# Altium project PS_DC-DC_15V_24V.PrjPcb
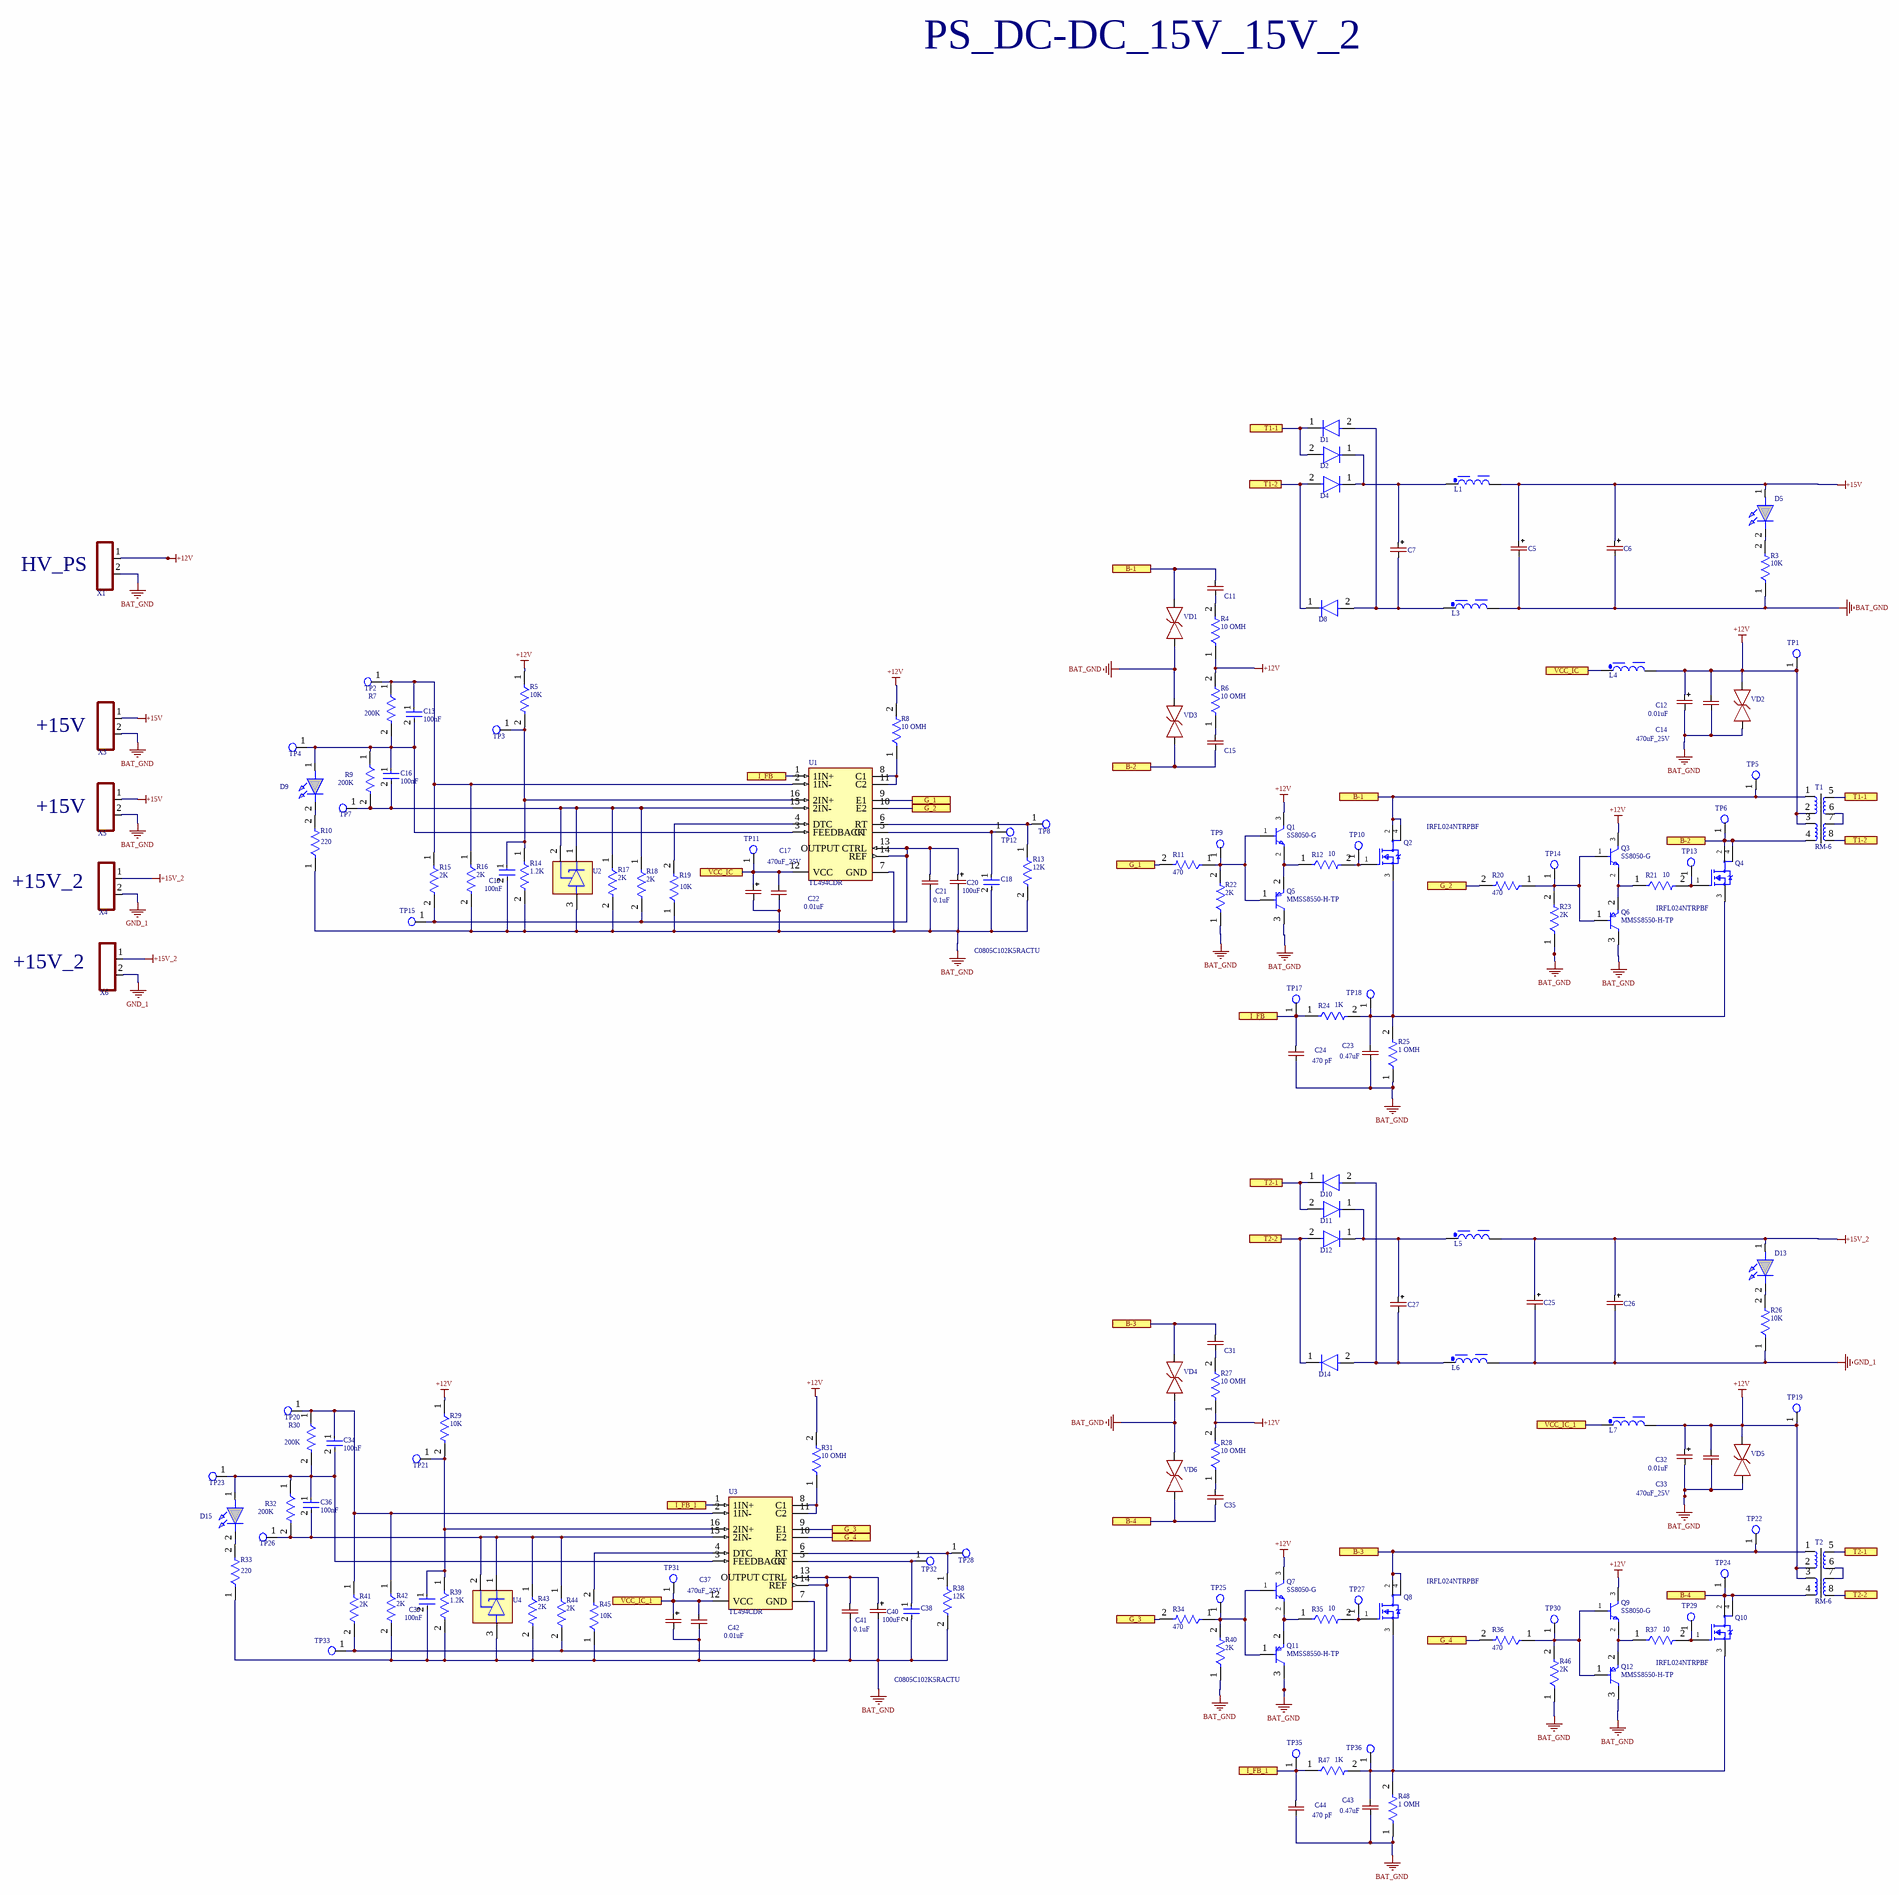
[diagram p0: PS_DC-DC_15V_24V.SchDoc]
1 sheet, 161 parts. Net scope: flat (ports and power ports of the same name join across sheets).
Board file: PS_DC-DC_15V_24V.PcbDoc

## Sheet PS_DC-DC_15V_24V.SchDoc
size A0; SheetNumber: 1; SheetTotal: 1; SPICEModelCacheYQEDCYZF: <root> / <DocumentId>YQEDCYZF</DocumentId> / <CacheFrame Number="0"> / <Model Name="7850_744775239_390u" Kind="CKT"> / <Text>******* / .subckt 7850_744775239_390u 1 2 / Rp 1 2 180000 / Cp 1 2 5p / Rs 1 N3 1.151 / L1 N3 2 390u / .ends 7850_744775239_390u</Text> / </Model> / </CacheFrame> / </root>

### Parts
C5  CAP-POLAR  [CAP_SMD_Size_G]  (value not drawn)
C6  CAP-POLAR  [CAP_SMD_Size_G]  (value not drawn)
C7  CAP-POLAR  [CAP_SMD_Size_G]  (value not drawn)
C11  CAP-V  [CAP-V]  (value not drawn)
C12  0.01uF  [CAP-0805]
C13  100nF  [FP-C0805C-DN-MFG]
C14  470uF_25V  [CAP_SMD_Size_G]
C15  CAP-V  [CAP-V]  (value not drawn)
C16  100nF  [FP-C0805C-DN-MFG]
C17  470uF_25V  [CAP_SMD_Size_G]
C18  C0805C102K5RACTU  [FP-C0805C-DN-MFG]
C19  100nF  [FP-C0805C-DN-MFG]
C20  100uF  [CAP-TAN-D]
C21  0.1uF  [CAP-0805]
C22  0.01uF  [CAP-0805]
C23  0.47uF  [CAP-0805]
C24  470 pF  [CAP-0805]
C25  CAP-POLAR  [CAP_SMD_Size_G]  (value not drawn)
C26  CAP-POLAR  [CAP_SMD_Size_G]  (value not drawn)
C27  CAP-POLAR  [CAP_SMD_Size_G]  (value not drawn)
C31  CAP-V  [CAP-V]  (value not drawn)
C32  0.01uF  [CAP-0805]
C33  470uF_25V  [CAP_SMD_Size_G]
C34  100nF  [FP-C0805C-DN-MFG]
C35  CAP-V  [CAP-V]  (value not drawn)
C36  100nF  [FP-C0805C-DN-MFG]
C37  470uF_25V  [CAP_SMD_Size_G]
C38  C0805C102K5RACTU  [FP-C0805C-DN-MFG]
C39  100nF  [FP-C0805C-DN-MFG]
C40  100uF  [CAP-TAN-D]
C41  0.1uF  [CAP-0805]
C42  0.01uF  [CAP-0805]
C43  0.47uF  [CAP-0805]
C44  470 pF  [CAP-0805]
D1  US1G  [DO-214AA]  (value not drawn)
D2  US1G  [DO-214AA]  (value not drawn)
D4  US1G  [DO-214AA]  (value not drawn)
D5  151031YS06000  [LED_RED]  (value not drawn)
D8  US1G  [DO-214AA]  (value not drawn)
D9  151031YS06000  [LED_RED]  (value not drawn)
D10  US1G  [DO-214AA]  (value not drawn)
D11  US1G  [DO-214AA]  (value not drawn)
D12  US1G  [DO-214AA]  (value not drawn)
D13  151031YS06000  [LED_RED]  (value not drawn)
D14  US1G  [DO-214AA]  (value not drawn)
D15  151031YS06000  [LED_RED]  (value not drawn)
L1  390µH, 0.38A  [WE-PD2_7850]  (value not drawn)
L3  390µH, 0.38A  [WE-PD2_7850]  (value not drawn)
L4  390µH, 0.38A  [WE-PD2_7850]  (value not drawn)
L5  390µH, 0.38A  [WE-PD2_7850]  (value not drawn)
L6  390µH, 0.38A  [WE-PD2_7850]  (value not drawn)
L7  390µH, 0.38A  [WE-PD2_7850]  (value not drawn)
Q1  SS8050-G  [FP-SS8050-G-MFG]
Q2  IRFL024NTRPBF  [FP-PG-SOT223-3-IPC_B]
Q3  SS8050-G  [FP-SS8050-G-MFG]
Q4  IRFL024NTRPBF  [FP-PG-SOT223-3-IPC_B]
Q5  MMSS8550-H-TP  [FP-SOT-23-IPC_B]
Q6  MMSS8550-H-TP  [FP-SOT-23-IPC_B]
Q7  SS8050-G  [FP-SS8050-G-MFG]
Q8  IRFL024NTRPBF  [FP-PG-SOT223-3-IPC_B]
Q9  SS8050-G  [FP-SS8050-G-MFG]
Q10  IRFL024NTRPBF  [FP-PG-SOT223-3-IPC_B]
Q11  MMSS8550-H-TP  [FP-SOT-23-IPC_B]
Q12  MMSS8550-H-TP  [FP-SOT-23-IPC_B]
R3  10K  [RES-0805]
R4  10 OMH  [RES-1206]
R5  10K  [FP-CRCW0805-e3-MFG]
R6  10 OMH  [RES-1206]
R7  200K  [FP-CRCW0805-e3-MFG]
R8  10 OMH  [RES-1206]
R9  200K  [FP-CRCW0805-e3-MFG]
R10  220  [RES-0805]
R11  470  [RES-0805]
R12  10  [RES-0805]
R13  12K  [FP-CRCW0805-e3-MFG]
R14  1.2K  [FP-CRCW0805-e3-MFG]
R15  2K  [FP-CRCW0805-e3-MFG]
R16  2K  [FP-CRCW0805-e3-MFG]
R17  2K  [FP-CRCW0805-e3-MFG]
R18  2K  [FP-CRCW0805-e3-MFG]
R19  10K  [RES-0805]
R20  470  [RES-0805]
R21  10  [RES-0805]
R22  2K  [RES-0805]
R23  2K  [RES-0805]
R24  1K  [RES-0805]
R25  1 OMH  [RES-2512]
R26  10K  [RES-0805]
R27  10 OMH  [RES-1206]
R28  10 OMH  [RES-1206]
R29  10K  [FP-CRCW0805-e3-MFG]
R30  200K  [FP-CRCW0805-e3-MFG]
R31  10 OMH  [RES-1206]
R32  200K  [FP-CRCW0805-e3-MFG]
R33  220  [RES-0805]
R34  470  [RES-0805]
R35  10  [RES-0805]
R36  470  [RES-0805]
R37  10  [RES-0805]
R38  12K  [FP-CRCW0805-e3-MFG]
R39  1.2K  [FP-CRCW0805-e3-MFG]
R40  2K  [RES-0805]
R41  2K  [FP-CRCW0805-e3-MFG]
R42  2K  [FP-CRCW0805-e3-MFG]
R43  2K  [FP-CRCW0805-e3-MFG]
R44  2K  [FP-CRCW0805-e3-MFG]
R45  10K  [RES-0805]
R46  2K  [RES-0805]
R47  1K  [RES-0805]
R48  1 OMH  [RES-2512]
T1  RM-6  [TRANS_RM6]
T2  RM-6  [TRANS_RM6]
TP1  (no value)  [Test_Point]
TP2  Test_Point_PCB  [Test_Point]  (value not drawn)
TP3  Test_Point_PCB  [Test_Point]  (value not drawn)
TP4  Test_Point_PCB  [Test_Point]  (value not drawn)
TP5  (no value)  [Test_Point]
TP6  (no value)  [Test_Point]
TP7  (no value)  [Test_Point]
TP8  (no value)  [Test_Point]
TP9  (no value)  [Test_Point]
TP10  (no value)  [Test_Point]
TP11  (no value)  [Test_Point]
TP12  Test_Point_PCB  [Test_Point]  (value not drawn)
TP13  (no value)  [Test_Point]
TP14  (no value)  [Test_Point]
TP15  Test_Point_PCB  [Test_Point]  (value not drawn)
TP17  (no value)  [Test_Point]
TP18  (no value)  [Test_Point]
TP19  (no value)  [Test_Point]
TP20  Test_Point_PCB  [Test_Point]  (value not drawn)
TP21  Test_Point_PCB  [Test_Point]  (value not drawn)
TP22  (no value)  [Test_Point]
TP23  Test_Point_PCB  [Test_Point]  (value not drawn)
TP24  (no value)  [Test_Point]
TP25  (no value)  [Test_Point]
TP26  (no value)  [Test_Point]
TP27  (no value)  [Test_Point]
TP28  (no value)  [Test_Point]
TP29  (no value)  [Test_Point]
TP30  (no value)  [Test_Point]
TP31  (no value)  [Test_Point]
TP32  Test_Point_PCB  [Test_Point]  (value not drawn)
TP33  Test_Point_PCB  [Test_Point]  (value not drawn)
TP35  (no value)  [Test_Point]
TP36  (no value)  [Test_Point]
U1  TL494CDR  [D0016A_N]
U2  TL431  [TL431_SOT-23-3(A)]  (value not drawn)
U3  TL494CDR  [D0016A_N]
U4  TL431  [TL431_SOT-23-3(A)]  (value not drawn)
VD1  Suppressor  [P6KE350CA]  (value not drawn)
VD2  Suppressor  [DO-214AA]  (value not drawn)
VD3  Suppressor  [P6KE350CA]  (value not drawn)
VD4  Suppressor  [P6KE350CA]  (value not drawn)
VD5  Suppressor  [DO-214AA]  (value not drawn)
VD6  Suppressor  [P6KE350CA]  (value not drawn)
X1  CONN-2-PIN  [XH2-]  (value not drawn)
X3  CONN-2-PIN  [XH2-]  (value not drawn)
X4  CONN-2-PIN  [XH2-]  (value not drawn)
X5  CONN-2-PIN  [XH2-]  (value not drawn)
X6  CONN-2-PIN  [XH2-]  (value not drawn)

### Ports
B-1, B-2, B-3, B-4, G_1, G_2, G_3, G_4, I_FB, I_FB_1, T1-1, T1-2, T2-1, T2-2, VCC_IC, VCC_IC_1

### Nets
+12V: C12.2 C14.1(+) C32.2 C33.1(+) L4.2 L7.2 Q1.3(C) Q3.3(C) Q7.3(C) Q9.3(C) R4.1 R5.1 R6.2 R8.2 R27.1 R28.2 R29.1 R31.2 T1.2 T1.3 T2.2 T2.3 TP1.1(G9) TP19.1(G9) VD2.2(A) VD5.2(A) X1.1
+15V: C5.1(+) C6.1(+) D5.1(A) L1.2 X3.1 X5.1
+15V_2: C25.1(+) C26.1(+) D13.1(A) L5.2 X4.1 X6.1
BAT_GND: C5.2(-) C6.2(-) C12.1 C14.2(-) C17.2(-) C18.2 C19.2 C20.2(-) C21.1 C22.1 C23.1 C24.1 C32.1 C33.2(-) C37.2(-) C38.2 C39.2 C40.2(-) C41.1 C42.1 C43.1 C44.1 L3.2 Q5.3(C) Q6.3(C) Q11.3(C) Q12.3(C) R3.1 R10.1 R13.2 R14.2 R16.2 R17.2 R19.1 R22.1 R23.1 R25.1 R33.1 R38.2 R39.2 R40.1 R42.2 R43.2 R45.1 R46.1 R48.1 U1.7(GND) U2.3(A) U3.7(GND) U4.3(A) VD1.1(C) VD2.1(C) VD3.2(A) VD4.1(C) VD5.1(C) VD6.2(A) X1.2 X3.2 X5.2
GND_1: C25.2(-) C26.2(-) L6.2 R26.1 X4.2 X6.2
NetC7_1: C7.1(+) D2.1(C) D4.1(C) L1.1
NetC7_2: C7.2(-) D1.2(A) D8.2(A) L3.1
NetC11_1: C11.1 R4.2
NetC11_2: C11.2 Q2.2(D) Q2.4(D) T1.1 TP5.1(G9) VD1.2(A) ; port B-1
NetC13_1: C13.1 R7.1 R15.1 R16.1 TP2.1(G9) U1.2(1IN-)
NetC13_2: C13.2 C16.1 D9.1(A) R7.2 R9.1 TP4.1(G9) U1.3(FEEDBACK)
NetC15_1: C15.1 Q4.2(D) Q4.4(D) T1.4 TP6.1(G9) VD3.1(C) ; port B-2
NetC15_2: C15.2 R6.1
NetC16_2: C16.2 R9.2 R17.1 R18.1 TP7.1(G9) U1.15(2IN-) U2.1(C) U2.2(REF)
NetC17_1: C17.1(+) C22.2 L4.1 TP11.1(G9) U1.12(VCC) ; port VCC_IC
NetC18_1: C18.1 TP12.1(G9) U1.5(CT)
NetC19_1: C19.1 R5.2 R14.1 TP3.1(G9) U1.16(2IN+)
NetC20_1: C20.1(+) C21.2 R15.2 R18.2 TP15.1(G9) U1.13(OUTPUT_CTRL) U1.14(REF)
NetC23_2: C23.2 Q2.3(S) Q4.3(S) R24.2 R25.2 TP18.1(G9)
NetC24_2: C24.2 R24.1 TP17.1(G9) U1.1(1IN+) ; port I_FB
NetC27_1: C27.1(+) D11.1(C) D12.1(C) L5.1
NetC27_2: C27.2(-) D10.2(A) D14.2(A) L6.1
NetC31_1: C31.1 R27.2
NetC31_2: C31.2 Q8.2(D) Q8.4(D) T2.1 TP22.1(G9) VD4.2(A) ; port B-3
NetC34_1: C34.1 R30.1 R41.1 R42.1 TP20.1(G9) U3.2(1IN-)
NetC34_2: C34.2 C36.1 D15.1(A) R30.2 R32.1 TP23.1(G9) U3.3(FEEDBACK)
NetC35_1: C35.1 Q10.2(D) Q10.4(D) T2.4 TP24.1(G9) VD6.1(C) ; port B-4
NetC35_2: C35.2 R28.1
NetC36_2: C36.2 R32.2 R43.1 R44.1 TP26.1(G9) U3.15(2IN-) U4.1(C) U4.2(REF)
NetC37_1: C37.1(+) C42.2 L7.1 TP31.1(G9) U3.12(VCC) ; port VCC_IC_1
NetC38_1: C38.1 TP32.1(G9) U3.5(CT)
NetC39_1: C39.1 R29.2 R39.1 TP21.1(G9) U3.16(2IN+)
NetC40_1: C40.1(+) C41.2 R41.2 R44.2 TP33.1(G9) U3.13(OUTPUT_CTRL) U3.14(REF)
NetC43_2: C43.2 Q8.3(S) Q10.3(S) R47.2 R48.2 TP36.1(G9)
NetC44_2: C44.2 R47.1 TP35.1(G9) U3.1(1IN+) ; port I_FB_1
NetD1_1: D1.1(C) D2.2(A) T1.5 ; port T1-1
NetD4_2: D4.2(A) D8.1(C) T1.8 ; port T1-2
NetD5_2: D5.2(K) R3.2
NetD9_2: D9.2(K) R10.2
NetD10_1: D10.1(C) D11.2(A) T2.5 ; port T2-1
NetD12_2: D12.2(A) D14.1(C) T2.8 ; port T2-2
NetD13_2: D13.2(K) R26.2
NetD15_2: D15.2(K) R33.2
NetQ1_1: Q1.1(B) Q5.1(B) R11.1 R22.2 TP9.1(G9)
NetQ1_2: Q1.2(E) Q5.2(E) R12.1
NetQ2_1: Q2.1(G) R12.2 TP10.1(G9)
NetQ3_1: Q3.1(B) Q6.1(B) R20.1 R23.2 TP14.1(G9)
NetQ3_2: Q3.2(E) Q6.2(E) R21.1
NetQ4_1: Q4.1(G) R21.2 TP13.1(G9)
NetQ7_1: Q7.1(B) Q11.1(B) R34.1 R40.2 TP25.1(G9)
NetQ7_2: Q7.2(E) Q11.2(E) R35.1
NetQ8_1: Q8.1(G) R35.2 TP27.1(G9)
NetQ9_1: Q9.1(B) Q12.1(B) R36.1 R46.2 TP30.1(G9)
NetQ9_2: Q9.2(E) Q12.2(E) R37.1
NetQ10_1: Q10.1(G) R37.2 TP29.1(G9)
NetR8_1: R8.1 U1.8(C1) U1.11(C2)
NetR11_2: R11.2 U1.9(E1) ; port G_1
NetR13_1: R13.1 TP8.1(G9) U1.6(RT)
NetR19_2: R19.2 U1.4(DTC)
NetR20_2: R20.2 U1.10(E2) ; port G_2
NetR31_1: R31.1 U3.8(C1) U3.11(C2)
NetR34_2: R34.2 U3.9(E1) ; port G_3
NetR36_2: R36.2 U3.10(E2) ; port G_4
NetR38_1: R38.1 TP28.1(G9) U3.6(RT)
NetR45_2: R45.2 U3.4(DTC)
NetT1_6: T1.6 T1.7
NetT2_6: T2.6 T2.7

### Notes on the sheet
- PS_DC-DC_15V_15V_2
- HV_PS
- +15V
- +15V_2

### Library data of the parts
C12 C21-C24 C32 C41-C44 = CAP-NON-POLAR
C13 C16 C19 C34 C36 C39 = CMP-2007-00254-2: CAP CER 10000PF 50V X7R 0805; Manufacturer Part Number: C0805C103J5RACTU; Manufacturer: KEMET; Value: 10,000 pF; Material: Ceramic; Temperature Coefficient: 30ppm/°C; Tolerance: 0.05; Device Class L1: Passive Components; Temperature: -55°C to +125°C; Lead Free: Yes; ComponentLink2URL: https://content.kemet.com/datasheets/KEM_C1003_C0G_SMD.pdf; Device Class L3: Ceramic Capacitors; Temperature Characteristic: X7R; Temperature Range High: +125°C; Mouser Description: Capacitor; Ceramic; Cap 0.01uF; Tol 5%; Vol-Rtg 50 V; SMT; Case 0805; X7R; TR; ComponentLink2Description: Datasheet; Height: 0.88mm; Digikey Description: CAP CER 10000PF 50V X7R 0805; Capacitance: 10,000 pF; Temperature Range Low: -55°C; Device Class L2: Capacitors; Octopart: https://octopart.com/c0805c103j5ractu-kemet-133473; Voltage Rating: 50 V; Category: Cap; RoHS: TRUE; Automotive: No; Package: C0805C-DN; Ipc Land Pattern Name: CAPC200125X78
C14 C17 C20 C33 C37 C40 = CAP-POLAR
C18 C38 = CMP-2007-01097-2: CAP CER 1000PF 50V X7R 0805; Manufacturer: KEMET; Capacitance: 1,000 pF; Value: 1,000 pF; Tolerance: 0.1; Temperature Coefficient: 30ppm/°C; Material: Ceramic; Temperature Range High: +125°C; Automotive: No; Device Class L3: Ceramic Capacitors; Category: Cap; Height: 0.88mm; Ipc Land Pattern Name: CAPC200125X78; Mouser Description: Cap Ceramic 0.001uF 50V X7R 10% SMD 0805 125C Plastic T/R; Device Class L1: Passive Components; Lead Free: Yes; Temperature Range Low: -55°C; ComponentLink2URL: https://content.kemet.com/datasheets/KEM_C1003_C0G_SMD.pdf; Octopart: https://octopart.com/c0805c102k5ractu-kemet-93010; Temperature: -55°C to +125°C; Package: C0805C-DN; RoHS: TRUE; Voltage Rating: 50 V; ComponentLink2Description: Datasheet; Digikey Description: CAP CER 1000PF 50V X7R 0805; Device Class L2: Capacitors; Manufacturer Part Number: C0805C102K5RACTU; Temperature Characteristic: X7R
D5 D9 D13 D15 = LED: WURTH ELEKTRONIK - 151031YS06000 - LED, Yellow, Through Hole, T-1 (3mm), 30 mA, 2 V, 590 nm; Geometry.Height: 5.5mm; Manufacturer_Name: Wurth Elektronik; Manufacturer_Part_Number: 151031YS06000; Mouser Part Number: 710-151031YS06000; Mouser Price/Stock: https://www.mouser.co.uk/ProductDetail/Wurth-Elektronik/151031YS06000?qs=LlUlMxKIyB3xSYYW%252BcuBiQ%3D%3D; Arrow Part Number: *; Arrow Price/Stock: *; Mouser Testing Part Number: *; Mouser Testing Price/Stock: *; Datasheet Link: https://katalog.we-online.de/led/datasheet/151031YS06000.pdf
L1 L3-L7 = 744775239: WE-PD2 SMT Power Inductor, size 7850, 390µH, 0.38A, 1.77Ω; Manufacturer: Wurth Elektronik; Case/Size Code: 7850; DC Resistance: 1.151Ω; Saturation Current: 0.43A; Self Resonant Frequency: 3.9MHz; Manufacturer Part Number: 744775239; Category: Unshielded Power Inductors; Match Code: WE-PD2; ComponentLink1Description: Website Link; ComponentLink1URL: https://www.we-online.com/redexpert/article/744775239?ad; ComponentLink2Description: Datasheet Link; ComponentLink2URL: https://www.we-online.com/redexpert/spec/744775239?ad; Mount: Surface Mount; Operating Temperature Max: 125°C; Operating Temperature Min: -40°C; Packaging: Tape and Reel; Length: 7.8mm; Width: 7mm; Height: 4.95mm; DC Resistance Max: 1.77Ω; Inductance: 390µH; Rated Current: 0.38A
Q1 Q3 Q7 Q9 = CMP-20235-000001-1: NPN TRANSISTOR 1.5A 40V SOT-23 R; Transition Frequency: 100MHz; Max Breakdown Voltage: 25V; Collector Emitter Voltage (VCEO): 400mV; Max Power Dissipation: 300mW; Max Collector Current: 1.5A; Case/Package: TO-236-3; Packaging: Tape and Reel; RoHS Compliant: Yes; Mount: Surface Mount; Collector Emitter Breakdown Voltage: 25V
Q2 Q4 Q8 Q10 = CMP-32901-001217-1: MOSFET N-CH 55V 2.8A SOT223; Max Power Dissipation: 1W; Turn-On Delay Time: 8.1ns; Drain to Source Resistance: 75mR; Gate to Source Voltage (Vgs): 20V; Polarization: N; Turn-Off Delay Time: 22.2ns; Threshold Voltage: 4V; Power Dissipation: 2.1W; Input Capacitance: 400pF; Number of Pins: 3; Max Operating Temperature: 150°C; Drain to Source Voltage (Vdss): 55V; RoHS Compliant: Yes; Case/Package: SOT-223; Series: HEXFET®; Lead Free: Contains Lead; Max Dual Supply Voltage: 55V; Packaging: Cut Tape; Drain to Source Breakdown Voltage: 55V; Reach SVHC Compliant: Yes; Mount: Surface Mount; Height: 0.057inch; Width: 0.146inch; Min Operating Temperature: -55°C; Rds On Max: 75mR; Halogen Free: Halogen Free; Continuous Drain Current (ID): 2.8A; Length: 0.263inch
Q5 Q6 Q11 Q12 = CMP-56214-000002-1: TRANS PNP 25V 1.5A SOT23; Emitter Base Voltage (VEBO): 1.6V; Collector Base Voltage (VCBO): 40V; Collector Emitter Saturation Voltage: 500mV; Max Power Dissipation: 625mW; Transition Frequency: 100MHz; Element Configuration: Single; hFE Min: 40; Polarity: PNP; Lead Free: Lead Free; Max Breakdown Voltage: 25V; Package Quantity: 1; Min Operating Temperature: -55°C; Case/Package: SOT-23; Max Collector Current: 1.5A; Mount: Surface Mount; Packaging: Tape and Reel; Collector Emitter Voltage (VCEO): 500mV; Max Operating Temperature: 150°C; Gain Bandwidth Product: 100MHz; Collector Emitter Breakdown Voltage: 25V
R3 R4 R6 R8 R10-R12 R19-R28 R31 R33-R37 R40 R45-R48 = RES-CONST
R5 R7 R9 R14 R15 R17 R18 R29 R30 R32 R39 R41 R43 R44 = CMP-2001-04908-2: RES Thick Film, 2kΩ, 1%, 0.125W, 100ppm/°C, 0805; Resistance: 10kR; Voltage Rating (DC): 150V; Power Rating: 125mW; Weight: 0.000194oz; Package Quantity: 5000; Military Standard: Not; Max Operating Temperature: 155°C; Temperature Coefficient: 100ppm/°C; Contact Plating: Tin; Width: 1.25mm; Height: 0.45mm; Radiation Hardening: No; Tolerance: 1%; Min Operating Temperature: -55°C; Voltage Rating: 150V; Length: 2mm; Depth: 1.25mm; Termination: SMD/SMT; Packaging: Tape and Reel; Case/Package: 0805; Case Code (Metric): 2012; Lead Free: Lead Free; Case Code (Imperial): 0805; Composition: Thick Film
R13 R38 = CMP-2001-04908-2: RES Thick Film, 12kΩ, 1%, 0.125W, 100ppm/°C, 0805; Resistance: 10kR; Voltage Rating (DC): 150V; Power Rating: 125mW; Weight: 0.000194oz; Package Quantity: 5000; Military Standard: Not; Max Operating Temperature: 155°C; Temperature Coefficient: 100ppm/°C; Contact Plating: Tin; Width: 1.25mm; Height: 0.45mm; Radiation Hardening: No; Tolerance: 1%; Min Operating Temperature: -55°C; Voltage Rating: 150V; Length: 2mm; Depth: 1.25mm; Termination: SMD/SMT; Packaging: Tape and Reel; Case/Package: 0805; Case Code (Metric): 2012; Lead Free: Lead Free; Case Code (Imperial): 0805; Composition: Thick Film
R16 R42 = CMP-2001-04908-2: RES Thick Film, 82kΩ, 1%, 0.125W, 100ppm/°C, 0805; Resistance: 10kR; Voltage Rating (DC): 150V; Power Rating: 125mW; Weight: 0.000194oz; Package Quantity: 5000; Military Standard: Not; Max Operating Temperature: 155°C; Temperature Coefficient: 100ppm/°C; Contact Plating: Tin; Width: 1.25mm; Height: 0.45mm; Radiation Hardening: No; Tolerance: 1%; Min Operating Temperature: -55°C; Voltage Rating: 150V; Length: 2mm; Depth: 1.25mm; Termination: SMD/SMT; Packaging: Tape and Reel; Case/Package: 0805; Case Code (Metric): 2012; Lead Free: Lead Free; Case Code (Imperial): 0805; Composition: Thick Film
T1 T2 = RM_6_12-12-18-18
TP1-TP15 TP17-TP33 TP35 TP36 = TP_PCB?: Test_Point
U1 U3 = CMP-0319-00950-2: Pulse-Width-Modulation Control Circuit with Voltage Control, 45 % Duty Cycle, 0 to +70 degC, 16-pin SOIC (D), Green (RoHS & no Sb/Br); Manufacturer: Texas Instruments; Regulated Outputs(#): 2; Frequency(Max)(kHz): 300; Topology: Boost, Buck, Flyback, Forward, Full-Bridge, Half-Bridge, Push-Pull; SubFamily: PWM Controller; Duty Cycle(Max)(%): 45; Rating: Military; PackageDescription: 16-Pin Plastic Small Outline Integrated Circuit, 9.9 x 3.9 mm, Pitch 1.27 mm Pitch; Mounting Technology: Surface Mount; PackageReference: D0016A; DatasheetVersion: SLVS074E; Control Method: Voltage; ComponentLink1Description: Datasheet; ComponentLink1URL: http://www.ti.com/general/docs/lit/getliterature.tsp?genericPartNumber=TL494&fileType=pdf; Code_JEDEC: MS-012AC; Eco-Plan: Green (RoHS & no Sb/Br); PackageVersion: revM, Jun-2011; PartNumber: TL494CDR
U2 U4 = TL431_SOT-23-3